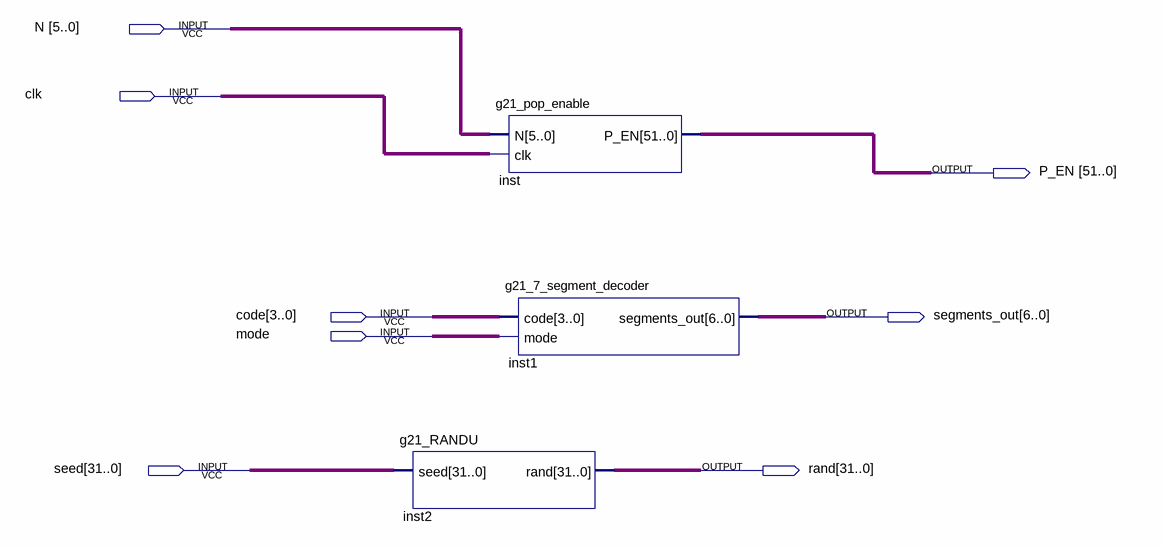
[diagram p0: schematic sheet]
// Quartus schematic g21_lab2.bdf as structural Verilog: 3 symbols, 8 pins
module g21_lab2 (
  input  [5:0] N,
  input  clk,
  input  [3:0] code,
  input  mode,
  input  [31:0] seed,
  output [51:0] P_EN,
  output [6:0] segments_out,
  output [31:0] \rand 
);

  g21_RANDU inst2 (.seed(seed), .\rand (\rand ));
  g21_pop_enable inst (.N(N), .clk(clk), .P_EN(P_EN));
  g21_7_segment_decoder inst1 (.code(code), .mode(mode), .segments_out(segments_out));
endmodule
